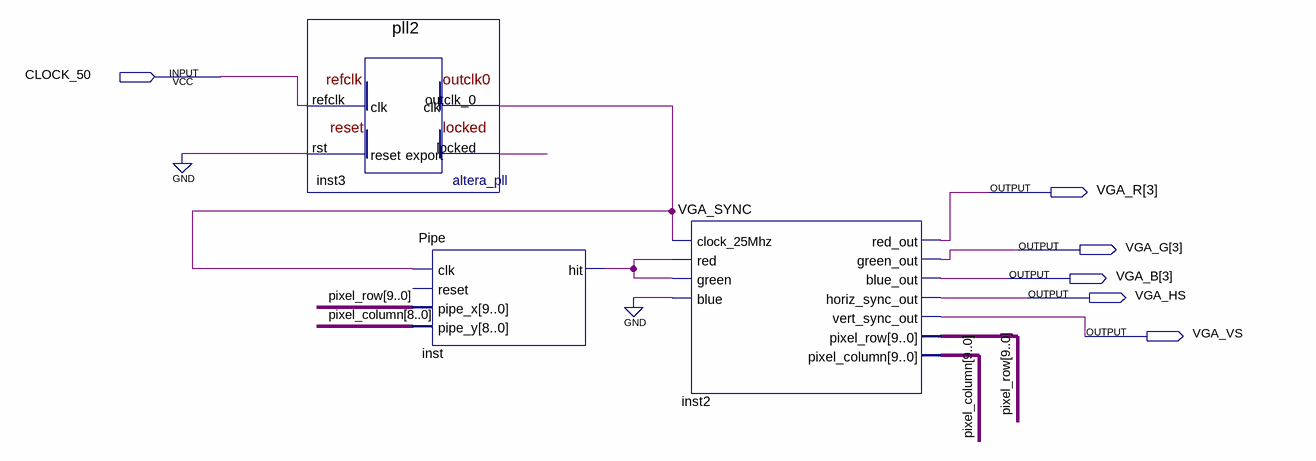
[diagram p0: schematic sheet]
// Quartus schematic pipes.bdf as structural Verilog: 3 symbols, 6 pins
module pipes (
  input  CLOCK_50,
  output [3:3] VGA_R,
  output [3:3] VGA_G,
  output [3:3] VGA_B,
  output VGA_HS,
  output VGA_VS
);

  wire inst3_locked, inst3_outclk_0, inst_hit;
  wire [9:0] pixel_column, pixel_row;

  pll2 inst3 (.refclk(CLOCK_50), .rst(1'b0), .outclk_0(inst3_outclk_0), .locked(inst3_locked));
  Pipe inst (.clk(inst3_outclk_0), .pipe_x(pixel_row), .pipe_y(pixel_column[8:0]), .hit(inst_hit));  // open: reset
  VGA_SYNC inst2 (
    .clock_25Mhz(inst3_outclk_0), .red(inst_hit), .green(inst_hit), .blue(1'b0), .red_out(VGA_R[3]),
    .green_out(VGA_G[3]), .blue_out(VGA_B[3]), .horiz_sync_out(VGA_HS), .vert_sync_out(VGA_VS),
    .pixel_row(pixel_row), .pixel_column(pixel_column));
endmodule
